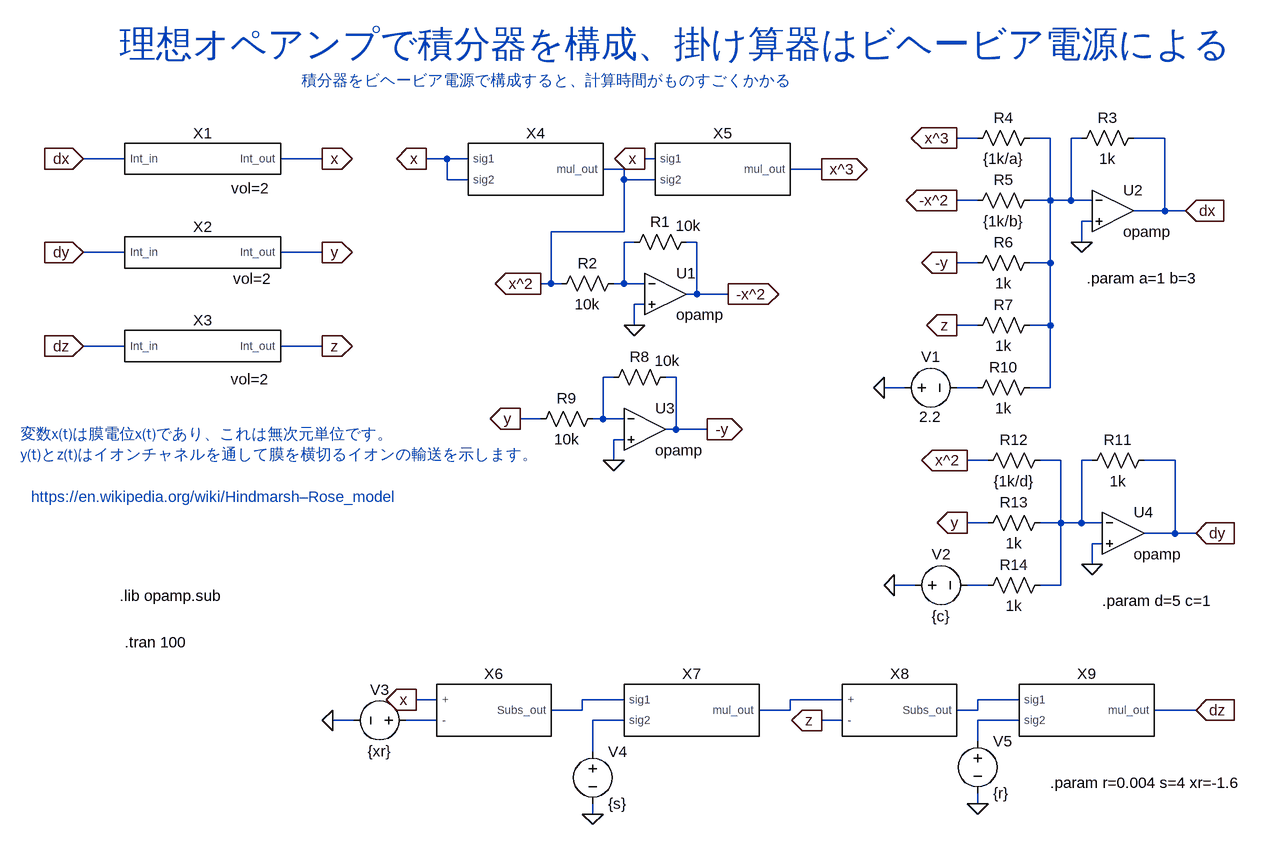
[diagram p0: schematic hindmarsh_neuronTemp.asc]
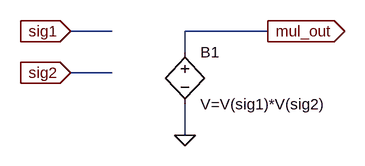
[diagram p1: sub-circuit mul_lv1.asc]
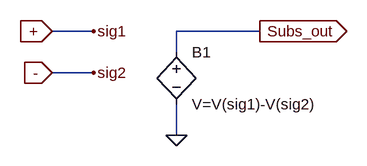
[diagram p2: sub-circuit sub_lv1.asc]
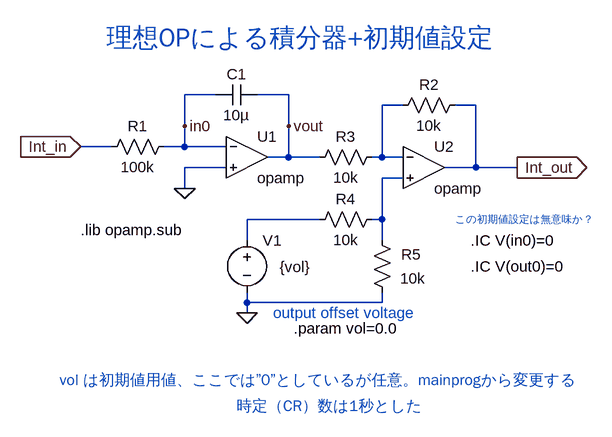
[diagram p3: sub-circuit int_lv2.asc]
hindmarsh_neuronTemp.asc, the LTspice schematic file:
Version 4.1
SHEET 1 1040 740
WIRE 592 -320 560 -320
WIRE 704 -320 672 -320
WIRE 752 -320 736 -320
WIRE 880 -320 832 -320
WIRE -720 -288 -784 -288
WIRE -416 -288 -480 -288
WIRE -224 -288 -256 -288
WIRE -192 -288 -224 -288
WIRE 96 -288 80 -288
WIRE 48 -272 16 -272
WIRE 352 -272 304 -272
WIRE -224 -256 -224 -288
WIRE -192 -256 -224 -256
WIRE 48 -256 48 -272
WIRE 96 -256 48 -256
WIRE 592 -224 560 -224
WIRE 704 -224 704 -320
WIRE 704 -224 672 -224
WIRE 736 -224 736 -320
WIRE 736 -224 704 -224
WIRE 768 -224 736 -224
WIRE 880 -208 880 -320
WIRE 880 -208 832 -208
WIRE 912 -208 880 -208
WIRE 768 -192 752 -192
WIRE 48 -176 48 -256
WIRE 48 -176 -64 -176
WIRE 64 -160 48 -160
WIRE 160 -160 144 -160
WIRE 752 -160 752 -192
WIRE -720 -144 -784 -144
WIRE -416 -144 -480 -144
WIRE 592 -128 560 -128
WIRE 704 -128 704 -224
WIRE 704 -128 672 -128
WIRE -64 -96 -64 -176
WIRE -64 -96 -80 -96
WIRE -48 -96 -64 -96
WIRE 48 -96 48 -160
WIRE 48 -96 32 -96
WIRE 80 -96 48 -96
WIRE 160 -80 160 -160
WIRE 160 -80 144 -80
WIRE 208 -80 160 -80
WIRE 80 -64 64 -64
WIRE 64 -32 64 -64
WIRE 592 -32 560 -32
WIRE 704 -32 704 -128
WIRE 704 -32 672 -32
WIRE -720 0 -784 0
WIRE -416 0 -480 0
WIRE 32 48 16 48
WIRE 128 48 112 48
WIRE 480 64 448 64
WIRE 592 64 560 64
WIRE 704 64 704 -32
WIRE 704 64 672 64
WIRE -80 112 -112 112
WIRE 16 112 16 48
WIRE 16 112 0 112
WIRE 48 112 16 112
WIRE 128 128 128 48
WIRE 128 128 112 128
WIRE 176 128 128 128
WIRE 48 144 32 144
WIRE 32 176 32 144
WIRE 608 176 576 176
WIRE 720 176 688 176
WIRE 768 176 752 176
WIRE 896 176 848 176
WIRE 608 272 576 272
WIRE 720 272 720 176
WIRE 720 272 688 272
WIRE 752 272 752 176
WIRE 752 272 720 272
WIRE 784 272 752 272
WIRE 896 288 896 176
WIRE 896 288 848 288
WIRE 928 288 896 288
WIRE 784 304 768 304
WIRE 768 336 768 304
WIRE 496 368 464 368
WIRE 608 368 576 368
WIRE 720 368 720 272
WIRE 720 368 688 368
WIRE -240 544 -272 544
WIRE 48 544 -16 544
WIRE 384 544 304 544
WIRE 656 544 592 544
WIRE -16 560 -16 544
WIRE -16 560 -64 560
WIRE 304 560 304 544
WIRE 304 560 256 560
WIRE 592 560 592 544
WIRE 592 560 560 560
WIRE 928 560 864 560
WIRE -368 576 -400 576
WIRE -240 576 -288 576
WIRE 48 576 0 576
WIRE 384 576 352 576
WIRE 656 576 592 576
WIRE 592 608 592 576
WIRE 0 624 0 576
WIRE 592 704 592 688
WIRE 0 720 0 704
FLAG -784 -288 dx
IOPIN -784 -288 In
FLAG -784 -144 dy
IOPIN -784 -144 In
FLAG -784 0 dz
IOPIN -784 0 In
FLAG -416 -144 y
IOPIN -416 -144 Out
FLAG -416 0 z
IOPIN -416 0 Out
FLAG -256 -288 x
IOPIN -256 -288 Out
FLAG 80 -288 x
IOPIN 80 -288 Out
FLAG -80 -96 x^2
IOPIN -80 -96 Out
FLAG 352 -272 x^3
IOPIN 352 -272 Out
FLAG 64 -32 0
FLAG 208 -80 -x^2
IOPIN 208 -80 Out
FLAG 752 -160 0
FLAG 912 -208 dx
IOPIN 912 -208 In
FLAG 560 -320 x^3
IOPIN 560 -320 Out
FLAG 560 -224 -x^2
IOPIN 560 -224 Out
FLAG 32 176 0
FLAG -112 112 y
IOPIN -112 112 Out
FLAG 176 128 -y
IOPIN 176 128 Out
FLAG 560 -128 -y
IOPIN 560 -128 Out
FLAG 560 -32 z
IOPIN 560 -32 Out
FLAG 448 64 0
FLAG 768 336 0
FLAG 576 176 x^2
IOPIN 576 176 Out
FLAG 576 272 y
IOPIN 576 272 Out
FLAG 464 368 0
FLAG 928 288 dy
IOPIN 928 288 In
FLAG -400 576 0
FLAG -272 544 x
IOPIN -272 544 Out
FLAG 0 720 0
FLAG 352 576 z
IOPIN 352 576 Out
FLAG 592 704 0
FLAG 928 560 dz
IOPIN 928 560 In
FLAG -416 -288 x
IOPIN -416 -288 Out
SYMBOL mul_lv1 -96 -272 R0
SYMATTR InstName X4
SYMBOL mul_lv1 192 -272 R0
SYMATTR InstName X5
SYMBOL OpAmps\\opamp 112 -144 R0
SYMATTR InstName U1
SYMBOL res 160 -176 R90
WINDOW 0 0 56 VBottom 2
WINDOW 3 -25 13 VTop 2
SYMATTR InstName R1
SYMATTR Value 10k
SYMBOL res 48 -112 R90
WINDOW 0 0 56 VBottom 2
WINDOW 3 32 56 VTop 2
SYMATTR InstName R2
SYMATTR Value 10k
SYMBOL OpAmps\\opamp 800 -272 R0
SYMATTR InstName U2
SYMBOL res 848 -336 R90
WINDOW 0 0 56 VBottom 2
WINDOW 3 32 56 VTop 2
SYMATTR InstName R3
SYMATTR Value 1k
SYMBOL res 688 -336 R90
WINDOW 0 0 56 VBottom 2
WINDOW 3 32 56 VTop 2
SYMATTR InstName R4
SYMATTR Value {1k/a}
SYMBOL res 688 -240 R90
WINDOW 0 0 56 VBottom 2
WINDOW 3 32 56 VTop 2
SYMATTR InstName R5
SYMATTR Value {1k/b}
SYMBOL res 688 -144 R90
WINDOW 0 0 56 VBottom 2
WINDOW 3 32 56 VTop 2
SYMATTR InstName R6
SYMATTR Value 1k
SYMBOL res 688 -48 R90
WINDOW 0 0 56 VBottom 2
WINDOW 3 32 56 VTop 2
SYMATTR InstName R7
SYMATTR Value 1k
SYMBOL OpAmps\\opamp 80 64 R0
SYMATTR InstName U3
SYMBOL res 128 32 R90
WINDOW 0 0 56 VBottom 2
WINDOW 3 -25 13 VTop 2
SYMATTR InstName R8
SYMATTR Value 10k
SYMBOL res 16 96 R90
WINDOW 0 0 56 VBottom 2
WINDOW 3 32 56 VTop 2
SYMATTR InstName R9
SYMATTR Value 10k
SYMBOL res 688 48 R90
WINDOW 0 0 56 VBottom 2
WINDOW 3 32 56 VTop 2
SYMATTR InstName R10
SYMATTR Value 1k
SYMBOL voltage 464 64 R270
WINDOW 0 32 56 VTop 2
WINDOW 3 -60 55 VTop 2
WINDOW 123 0 0 Left 0
WINDOW 39 0 0 Left 0
SYMATTR InstName V1
SYMATTR Value 2.2
SYMBOL OpAmps\\opamp 816 224 R0
SYMATTR InstName U4
SYMBOL res 864 160 R90
WINDOW 0 0 56 VBottom 2
WINDOW 3 32 56 VTop 2
SYMATTR InstName R11
SYMATTR Value 1k
SYMBOL res 704 160 R90
WINDOW 0 0 56 VBottom 2
WINDOW 3 32 56 VTop 2
SYMATTR InstName R12
SYMATTR Value {1k/d}
SYMBOL res 704 256 R90
WINDOW 0 0 56 VBottom 2
WINDOW 3 32 56 VTop 2
SYMATTR InstName R13
SYMATTR Value 1k
SYMBOL res 704 352 R90
WINDOW 0 0 56 VBottom 2
WINDOW 3 32 56 VTop 2
SYMATTR InstName R14
SYMATTR Value 1k
SYMBOL voltage 480 368 R270
WINDOW 0 32 56 VTop 2
WINDOW 3 -32 56 VBottom 2
WINDOW 123 0 0 Left 0
WINDOW 39 0 0 Left 0
SYMATTR InstName V2
SYMATTR Value {c}
SYMBOL sub_lv1 -160 560 R0
SYMATTR InstName X6
SYMBOL mul_lv1 144 560 R0
SYMATTR InstName X7
SYMBOL sub_lv1 464 560 R0
SYMATTR InstName X8
SYMBOL voltage -272 576 M270
WINDOW 0 32 56 VTop 2
WINDOW 3 -32 56 VBottom 2
WINDOW 123 0 0 Left 0
WINDOW 39 0 0 Left 0
SYMATTR InstName V3
SYMATTR Value {xr}
SYMBOL voltage 0 608 R0
WINDOW 123 0 0 Left 0
WINDOW 39 0 0 Left 0
SYMATTR InstName V4
SYMATTR Value {s}
SYMBOL voltage 592 592 R0
WINDOW 123 0 0 Left 0
WINDOW 39 0 0 Left 0
SYMATTR InstName V5
SYMATTR Value {r}
SYMBOL mul_lv1 752 560 R0
SYMATTR InstName X9
SYMBOL INT_lv2 -608 -288 R0
WINDOW 1 -80 32 Left 1
WINDOW 39 81 61 Bottom 2
SYMATTR SpiceLine vol=2
SYMATTR InstName X1
SYMBOL INT_lv2 -608 -144 R0
WINDOW 1 -80 32 Left 1
WINDOW 39 84 56 Bottom 2
SYMATTR SpiceLine vol=2
SYMATTR InstName X2
SYMBOL INT_lv2 -608 0 R0
WINDOW 1 -80 32 Left 1
WINDOW 39 51 51 Left 2
SYMATTR SpiceLine vol=2
SYMATTR InstName X3
TEXT -728 384 Left 2 !.lib opamp.sub
TEXT 760 -104 Left 2 !.param a=1 b=3
TEXT 784 392 Left 2 !.param d=5 c=1
TEXT 704 672 Left 2 !.param r=0.004 s=4 xr=-1.6
TEXT -720 456 Left 2 !.tran 100
TEXT -864 232 Left 2 ;https://en.wikipedia.org/wiki/Hindmarsh–Rose_model
TEXT -728 -464 Left 5 ;理想オペアンプで積分器を構成、掛け算器はビヘービア電源による
TEXT -448 -408 Left 2 ;積分器をビヘービア電源で構成すると、計算時間がものすごくかかる
TEXT -880 136 Left 2 ;変数x(t)は膜電位x(t)であり、これは無次元単位です。\ny(t)とz(t)はイオンチャネルを通して膜を横切るイオンの輸送を示します。

mul_lv1.asc, the sub-circuit schematic file:
Version 4.1
SHEET 1 880 680
WIRE 0 64 -64 64
WIRE 240 64 112 64
WIRE 112 96 112 64
WIRE 0 128 -64 128
WIRE 112 224 112 176
FLAG 112 224 0
FLAG -64 64 sig1
IOPIN -64 64 In
FLAG 240 64 mul_out
IOPIN 240 64 Out
FLAG -64 128 sig2
IOPIN -64 128 In
SYMBOL bv 112 80 R0
SYMATTR InstName B1
SYMATTR Value V=V(sig1)*V(sig2)

sub_lv1.asc, the sub-circuit schematic file:
Version 4.1
SHEET 1 880 680
WIRE 32 80 -32 80
WIRE 288 80 160 80
WIRE 160 112 160 80
WIRE 32 144 -32 144
WIRE 160 240 160 192
FLAG 160 240 0
FLAG 32 80 sig1
FLAG 32 144 sig2
FLAG 288 80 Subs_out
IOPIN 288 80 Out
FLAG -32 80 +
IOPIN -32 80 In
FLAG -32 144 -
IOPIN -32 144 In
SYMBOL bv 160 96 R0
SYMATTR InstName B1
SYMATTR Value V=V(sig1)-V(sig2)

int_lv2.asc, the sub-circuit schematic file:
Version 4.1
SHEET 1 880 680
WIRE 16 -128 -32 -128
WIRE 128 -128 80 -128
WIRE 304 -112 272 -112
WIRE 416 -112 384 -112
WIRE -32 -80 -32 -128
WIRE 128 -80 128 -128
WIRE -144 -48 -192 -48
WIRE -32 -48 -32 -80
WIRE -32 -48 -64 -48
WIRE 32 -48 -32 -48
WIRE 128 -32 128 -80
WIRE 128 -32 96 -32
WIRE 176 -32 128 -32
WIRE 272 -32 272 -112
WIRE 272 -32 256 -32
WIRE 304 -32 272 -32
WIRE 32 -16 -32 -16
WIRE 416 -16 416 -112
WIRE 416 -16 368 -16
WIRE 480 -16 416 -16
WIRE 304 0 272 0
WIRE -32 16 -32 -16
WIRE 176 64 64 64
WIRE 272 64 272 0
WIRE 272 64 256 64
WIRE 64 96 64 64
WIRE 272 96 272 64
WIRE 64 192 64 176
WIRE 272 192 272 176
WIRE 272 192 64 192
WIRE 64 208 64 192
FLAG -192 -48 Int_in
IOPIN -192 -48 In
FLAG 128 -80 vout
FLAG 480 -16 Int_out
IOPIN 480 -16 Out
FLAG -32 -80 in0
FLAG -32 16 0
FLAG 64 208 0
SYMBOL cap 16 -112 R270
WINDOW 0 32 32 VTop 2
WINDOW 3 0 32 VBottom 2
SYMATTR InstName C1
SYMATTR Value 10µ
SYMBOL res -48 -64 R90
WINDOW 0 0 56 VBottom 2
WINDOW 3 32 56 VTop 2
SYMATTR InstName R1
SYMATTR Value 100k
SYMBOL OpAmps\\opamp 64 -96 R0
SYMATTR InstName U1
SYMATTR SpiceLine Aol=10meg
SYMATTR SpiceLine2 GBW=1g
SYMBOL OpAmps\\opamp 336 -80 R0
SYMATTR InstName U2
SYMATTR SpiceLine Aol=10meg
SYMATTR SpiceLine2 GBW=1g
SYMBOL res 400 -128 R90
WINDOW 0 0 56 VBottom 2
WINDOW 3 32 56 VTop 2
SYMATTR InstName R2
SYMATTR Value 10k
SYMBOL res 272 -48 R90
WINDOW 0 0 56 VBottom 2
WINDOW 3 32 56 VTop 2
SYMATTR InstName R3
SYMATTR Value 10k
SYMBOL res 272 48 R90
WINDOW 0 0 56 VBottom 2
WINDOW 3 32 56 VTop 2
SYMATTR InstName R4
SYMATTR Value 10k
SYMBOL res 288 192 R180
WINDOW 0 -44 74 Left 2
WINDOW 3 -51 37 Left 2
SYMATTR InstName R5
SYMATTR Value 10k
SYMBOL voltage 64 80 R0
WINDOW 123 0 0 Left 0
WINDOW 39 0 0 Left 0
WINDOW 3 50 57 Left 2
SYMATTR Value {vol}
SYMATTR InstName V1
TEXT -192 80 Left 2 !.lib opamp.sub
TEXT 136 232 Left 2 !.param vol=0.0
TEXT -224 312 Left 2 ;vol は初期値用値、ここでは”0”としているが任意。mainprogから変更する
TEXT 48 352 Left 2 ;時定（CR）数は1秒とした
TEXT 104 208 Left 2 ;output offset voltage
TEXT 408 96 Left 2 !.IC V(in0)=0
TEXT 408 136 Left 2 !.IC V(out0)=0
TEXT 384 64 Left 1 ;この初期値設定は無意味か？
TEXT -152 -216 Left 4 ;理想OPによる積分器+初期値設定

The netlist it stands for:
* hindmarsh_neuronTemp.asc
X§X4 x x x^2 mul_lv1
X§X5 x x^2 x^3 mul_lv1
X§U1 N002 0 -x^2 opamp Aol=100K GBW=10Meg  ; pins invin noninvin out
R1 -x^2 N002 10k
R2 N002 x^2 10k
X§U2 N001 0 dx opamp Aol=100K GBW=10Meg  ; pins invin noninvin out
R3 dx N001 1k
R4 N001 x^3 {1k/a}
R5 N001 -x^2 {1k/b}
R6 N001 -y 1k
R7 N001 z 1k
X§U3 N003 0 -y opamp Aol=100K GBW=10Meg  ; pins invin noninvin out
R8 -y N003 10k
R9 N003 y 10k
R10 N001 N004 1k
V1 0 N004 2.2
X§U4 N005 0 dy opamp Aol=100K GBW=10Meg  ; pins invin noninvin out
R11 dy N005 1k
R12 N005 x^2 {1k/d}
R13 N005 y 1k
R14 N005 N006 1k
V2 0 N006 {c}
X§X6 x N010 N007 sub_lv1
X§X7 N007 N011 N008 mul_lv1
X§X8 N008 z N009 sub_lv1
V3 N010 0 {xr}
V4 N011 0 {s}
V5 N012 0 {r}
X§X9 N009 N012 dz mul_lv1
X§X1 dx x int_lv2 params: vol=2
X§X2 dy y int_lv2 params: vol=2
X§X3 dz z int_lv2 params: vol=2

* block symbol definitions
.subckt mul_lv1 sig1 sig2 mul_out
B1 mul_out 0 V=V(sig1)*V(sig2)
.ends mul_lv1

.subckt sub_lv1 + - Subs_out
B1 Subs_out 0 V=V(sig1)-V(sig2)
.ends sub_lv1

.subckt int_lv2 Int_in Int_out
C1 in0 vout 10µ
R1 in0 Int_in 100k
X§U1 in0 0 vout opamp Aol=10meg GBW=1g  ; pins invin noninvin out
X§U2 N001 N002 Int_out opamp Aol=10meg GBW=1g  ; pins invin noninvin out
R2 Int_out N001 10k
R3 N001 vout 10k
R4 N002 N003 10k
R5 0 N002 10k
V1 N003 0 {vol}
.lib opamp.sub
.param vol=0.0
* vol は初期値用値、ここでは”0”としているが任意。mainprogから変更する
* 時定（CR）数は1秒とした
* output offset voltage
.IC V(in0)=0
.IC V(out0)=0
* この初期値設定は無意味か？
* 理想OPによる積分器+初期値設定
.ends int_lv2

.lib opamp.sub
.param a=1 b=3
.param d=5 c=1
.param r=0.004 s=4 xr=-1.6
.tran 100
* https://en.wikipedia.org/wiki/Hindmarsh–Rose_model
* 理想オペアンプで積分器を構成、掛け算器はビヘービア電源による
* 積分器をビヘービア電源で構成すると、計算時間がものすごくかかる
* 変数x(t)は膜電位x(t)であり、これは無次元単位です。
* y(t)とz(t)はイオンチャネルを通して膜を横切るイオンの輸送を示します。
.backanno
.end